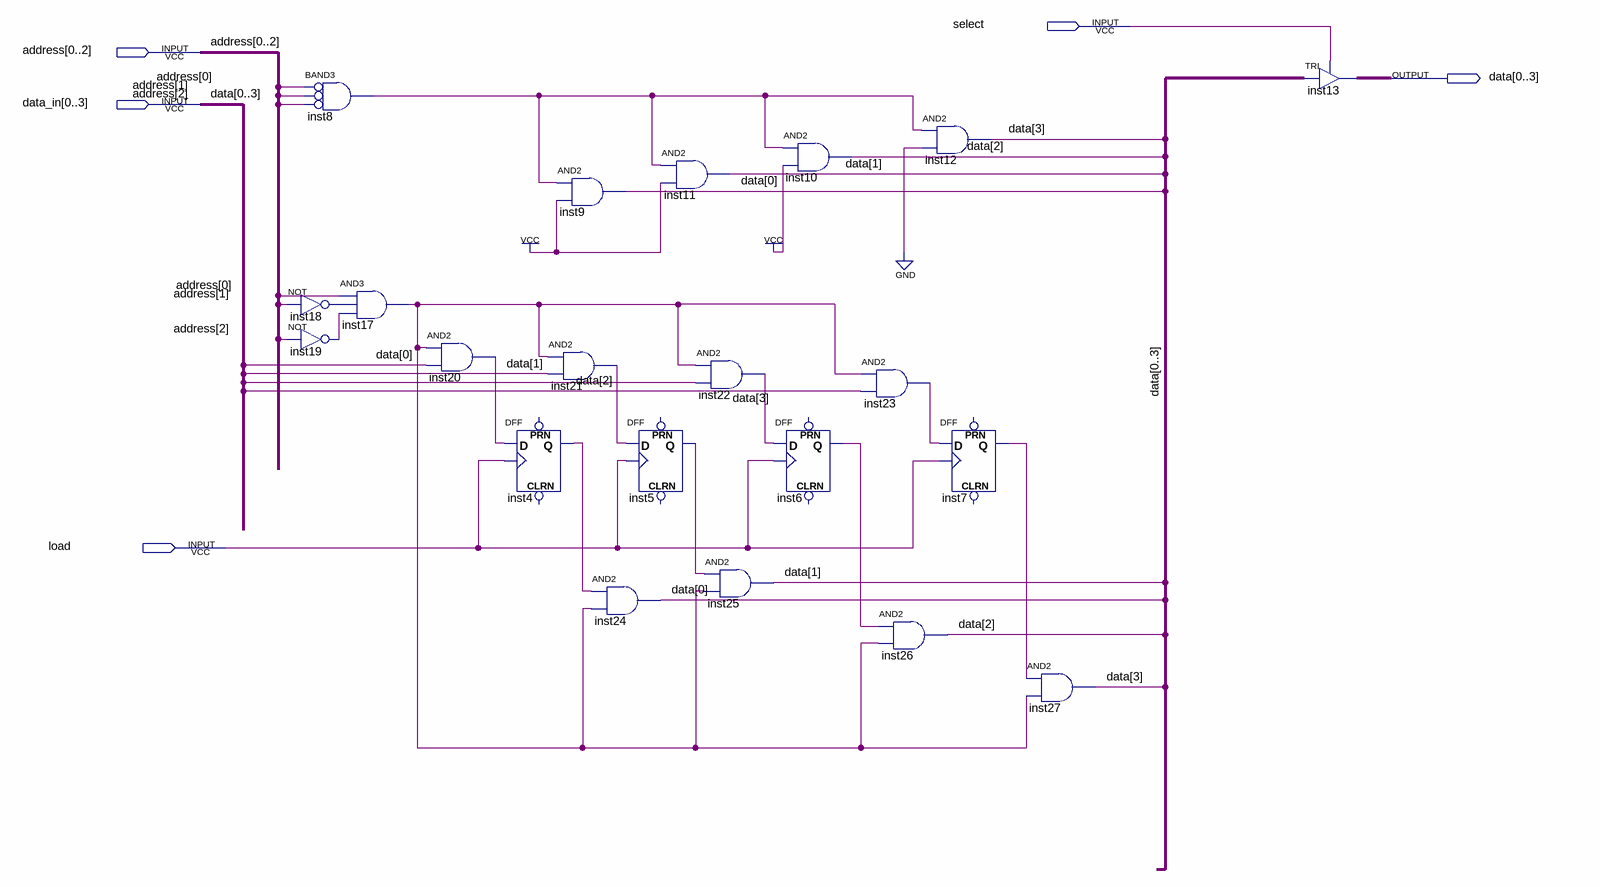
[diagram p0: schematic sheet]
// Quartus schematic data_memory.bdf as structural Verilog: 21 symbols, 5 pins
module data_memory (
  input  select,
  input  [0:2] address,
  input  [0:3] data_in,
  input  load,
  output [0:3] data
);

  wire inst4_q, inst5_q, inst6_q, inst7_q, inst8_out, inst17_out, inst18_out, inst19_out, inst20_out,
       inst21_out, inst22_out, inst23_out;

  and inst8 (inst8_out, ~address[0], ~address[1], ~address[2]);  // BAND3
  not inst18 (inst18_out, address[1]);
  not inst19 (inst19_out, address[2]);
  and inst17 (inst17_out, address[0], inst18_out, inst19_out);
  and inst20 (inst20_out, inst17_out, data_in[0]);
  DFF inst4 (.CLK(load), .D(inst20_out), .Q(inst4_q));  // open: CLRN, PRN
  and inst9 (data_in[0], inst8_out, 1'b1);
  and inst21 (inst21_out, inst17_out, data_in[1]);
  and inst24 (data_in[0], inst4_q, inst17_out);
  and inst11 (data_in[1], inst8_out, 1'b1);
  DFF inst5 (.CLK(load), .D(inst21_out), .Q(inst5_q));  // open: CLRN, PRN
  and inst22 (inst22_out, inst17_out, data_in[2]);
  and inst25 (data_in[1], inst5_q, inst17_out);
  and inst10 (data_in[2], inst8_out, 1'b1);
  DFF inst6 (.CLK(load), .D(inst22_out), .Q(inst6_q));  // open: CLRN, PRN
  and inst23 (inst23_out, inst17_out, data_in[3]);
  and inst12 (data_in[3], inst8_out, 1'b0);
  DFF inst7 (.CLK(load), .D(inst23_out), .Q(inst7_q));  // open: CLRN, PRN
  and inst26 (data_in[2], inst6_q, inst17_out);
  and inst27 (data_in[3], inst7_q, inst17_out);
  TRI inst13[3:0] (.IN(data_in), .OE(select), .OUT(data_in));

  assign data = data_in;
endmodule
